# EAGLE design sensor-i2c-proto (EAGLE 9.0.0)
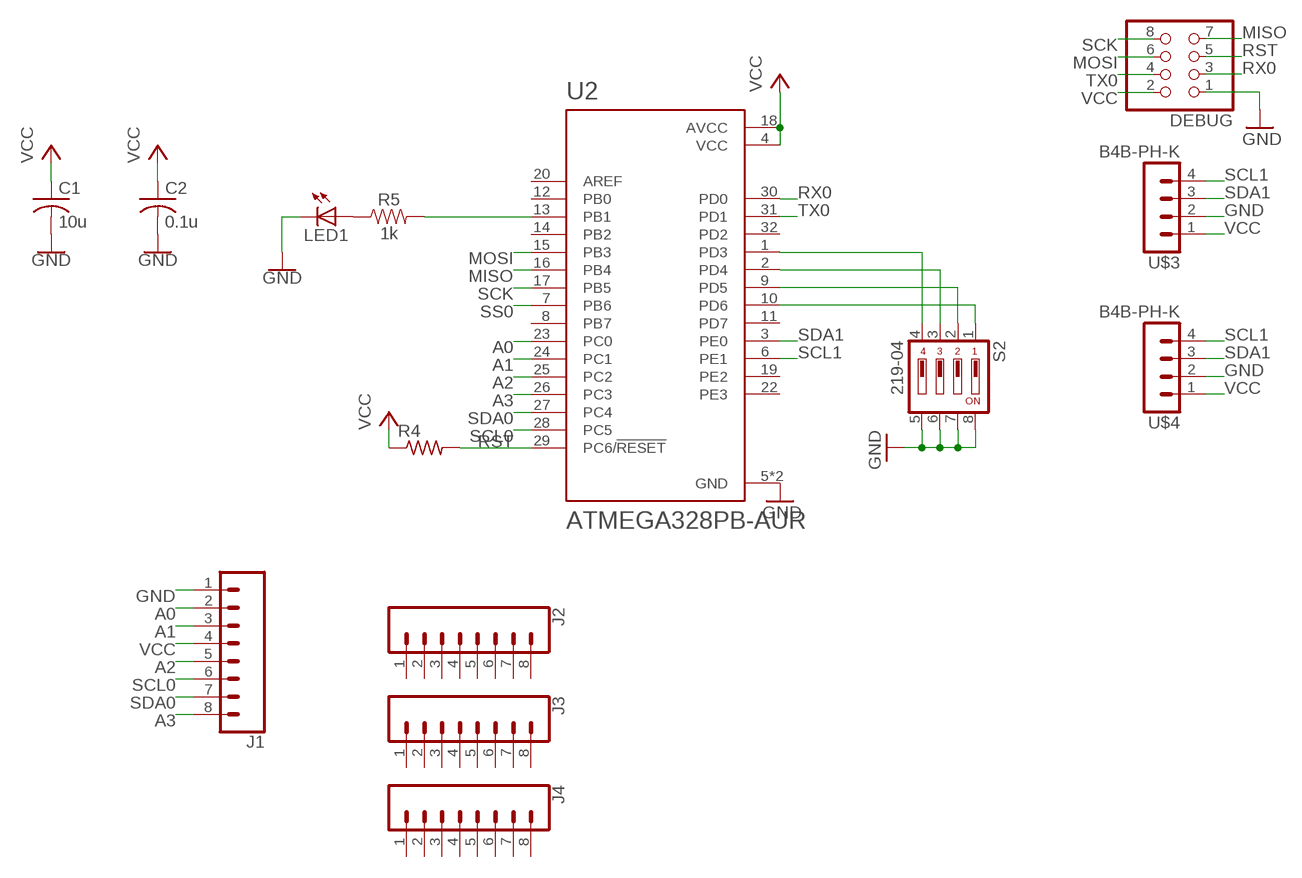
[diagram p0: schematic, sheet 1]

## Parts
C1  10u  C-USC0603  [C0603]
C2  0.1u  C-USC0603  [C0603]
DEBUG  PINHD-2X4  [2X04]
J1  CONN_08"  [1X08]
J2  CONN_08NO_SILK_FEMALE_PTH  [1X08_NO_SILK]
J3  CONN_08NO_SILK_FEMALE_PTH  [1X08_NO_SILK]
J4  CONN_08NO_SILK_FEMALE_PTH  [1X08_NO_SILK]
LED1  LEDSML0805  [SML0805]
R4  R-US_R0603  [R0603]
R5  1k  1KOHM-0603-1/10W-1%  [0603]
S2  219-04  [CTS-219-04]
U2  ATMEGA328PB-AUR  [QFP80P900X900X120-32N]
U$3  B4B-PH-K  [B4B-PH-K]
U$4  B4B-PH-K  [B4B-PH-K]

## Nets
A0: J1.2 U2.23(PC0)
A1: J1.3 U2.24(PC1)
A2: J1.5 U2.25(PC2)
A3: J1.8 U2.26(PC3)
GND: C1.2 C2.2 DEBUG.1 J1.1 LED1.C S2.5 S2.6 S2.7 S2.8 U2.5(GND) U2.21(GND) U$3.2 U$4.2
MISO: DEBUG.7 U2.16(PB4)
MOSI: DEBUG.6 U2.15(PB3)
N$1: S2.4 U2.1(PD3)
N$2: S2.3 U2.2(PD4)
N$3: S2.2 U2.9(PD5)
N$4: S2.1 U2.10(PD6)
N$12: LED1.A R5.1
N$13: R5.2 U2.13(PB1)
RST: DEBUG.5 R4.2 U2.29(PC6/!RESET)
RX0: DEBUG.3 U2.30(PD0)
SCK: DEBUG.8 U2.17(PB5)
SCL0: J1.6 U2.28(PC5)
SCL1: U2.6(PE1) U$3.4 U$4.4
SDA0: J1.7 U2.27(PC4)
SDA1: U2.3(PE0) U$3.3 U$4.3
SS0: U2.7(PB6)
TX0: DEBUG.4 U2.31(PD1)
VCC: C1.1 C2.1 DEBUG.2 J1.4 R4.1 U2.4(VCC) U2.18(AVCC) U$3.1 U$4.1
Unconnected: J2.1 J2.2 J2.3 J2.4 J2.5 J2.6 J2.7 J2.8 J3.1 J3.2 J3.3 J3.4 J3.5 J3.6 J3.7 J3.8 J4.1 J4.2 J4.3 J4.4 J4.5 J4.6 J4.7 J4.8 U2.8(PB7) U2.11(PD7) U2.12(PB0) U2.14(PB2) U2.19(PE2) U2.20(AREF) U2.22(PE3) U2.32(PD2)

## Library data of the parts
C1 C2 = resistor:C-US: CAPACITOR, American symbol
DEBUG = pinhead:PINHD-2X4: PIN HEADER
J1-J4 = SparkFun-Connectors:CONN_08: Multi connection point. Often used as Generic Header-pin footprint for 0.1 inch spaced/style header connections On any of the 0.1 inch spaced packages, you can populate with these: Break Away Headers - Straight <https://www.sparkfun.com/products/116> (PRT-00116) Break Away Male Headers - Right Angle <https://www.sparkfun.com/products/553> (PRT-00553) Female Headers <https://www.sparkfun.com/products/115> (PRT-00115) Break Away Headers - Machine Pin <https://www.sparkfun.com/products/117> (PRT-00117) Break Away Female Headers - Swiss Machine Pin <https://www.sparkfun.com/products/743> (PRT-00743) Arduino Stackable Header - 8 Pin <https://www.sparkfun.com/products/9279> (PRT-09279) For SCREWTERMINALS and SPRING TERMINALS visit here: Screw Terimnals on SparkFun.com <https://www.sparkfun.com/search/results?term=Screw+Terminals> (5mm/3.5mm/2.54mm spacing) This device is also useful as a general connection point to wire up your design to another part of your project. Our various solder wires solder well into these plated through hole pads. Hook-Up Wire - Assortment (Stranded, 22 AWG) <https://www.sparkfun.com/products/11375> (PRT-11375) Hook-Up Wire - Assortment (Solid Core, 22 AWG) <https://www.sparkfun.com/products/11367> (PRT-11367) View the entire wire category on our website here <https://www.sparkfun.com/categories/141> Special notes: Molex polarized connector foot print use with SKU : PRT-08231 with associated crimp pins and housings. 1MM SMD Version SKU: PRT-10208 NOTES ON THE VARIANTS LOCK and LOCK_LONGPADS... This footprint was designed to help hold the alignment of a through-hole component (i.e. 6-pin header) while soldering it into place. You may notice that each hole has been shifted either up or down by 0.005 of an inch from it's more standard position (which is a perfectly straight line). This slight alteration caused the pins (the squares in the middle) to touch the edges of the holes. Because they are alternating, it causes a "brace" to hold the component in place. 0.005 has proven to be the perfect amount of "off-center" position when using our standard breakaway headers. Although looks a little odd when you look at the bare footprint, once you have a header in there, the alteration is very hard to notice. Also,if you push a header all the way into place, it is covered up entirely on the bottom side.; PROD_ID: CONN-08438
LED1 = led:LED: LED OSRAM: - CHIPLED LG R971, LG N971, LY N971, LG Q971, LY Q971, LO R971, LY R971 LH N974, LH R974 LS Q976, LO Q976, LY Q976 LO Q996 - Hyper CHIPLED LW Q18S LB Q993, LB Q99A, LB R99A - SideLED LS A670, LO A670, LY A670, LG A670, LP A670 LB A673, LV A673, LT A673, LW A673 LH A674 LY A675 LS A676, LA A676, LO A676, LY A676, LW A676 LS A679, LY A679, LG A679 - Hyper Micro SIDELED® LS Y876, LA Y876, LO Y876, LY Y876 LT Y87S - SmartLED LW L88C, LW L88S LB L89C, LB L89S, LG L890 LS L89K, LO L89K, LY L89K LS L896, LA L896, LO L896, LY L896 - TOPLED LS T670, LO T670, LY T670, LG T670, LP T670 LSG T670, LSP T670, LSY T670, LOP T670, LYG T670 LG T671, LOG T671, LSG T671 LB T673, LV T673, LT T673, LW T673 LH T674 LS T676, LA T676, LO T676, LY T676, LB T676, LH T676, LSB T676, LW T676 LB T67C, LV T67C, LT T67C, LS T67K, LO T67K, LY T67K, LW E67C LS E67B, LA E67B, LO E67B, LY E67B, LB E67C, LV E67C, LT E67C LW T67C LS T679, LY T679, LG T679 LS T770, LO T770, LY T770, LG T770, LP T770 LB T773, LV T773, LT T773, LW T773 LH T774 LS E675, LA E675, LY E675, LS T675 LS T776, LA T776, LO T776, LY T776, LB T776 LHGB T686 LT T68C, LB T68C - Hyper Mini TOPLED® LB M676 - Mini TOPLED Santana® LG M470 LS M47K, LO M47K, LY M47K Source: http://www.osram.convergy.de LUXEON: - LUMILED® LXK2-PW12-R00, LXK2-PW12-S00, LXK2-PW14-U00, LXK2-PW14-V00 LXK2-PM12-R00, LXK2-PM12-S00, LXK2-PM14-U00 LXK2-PE12-Q00, LXK2-PE12-R00, LXK2-PE12-S00, LXK2-PE14-T00, LXK2-PE14-U00 LXK2-PB12-K00, LXK2-PB12-L00, LXK2-PB12-M00, LXK2-PB14-N00, LXK2-PB14-P00, LXK2-PB14-Q00 LXK2-PR12-L00, LXK2-PR12-M00, LXK2-PR14-Q00, LXK2-PR14-R00 LXK2-PD12-Q00, LXK2-PD12-R00, LXK2-PD12-S00 LXK2-PH12-R00, LXK2-PH12-S00 LXK2-PL12-P00, LXK2-PL12-Q00, LXK2-PL12-R00 Source: www.luxeon.com KINGBRIGHT: KA-3528ASYC Source: www.kingbright.com
R4 = resistor:R-US_: RESISTOR, American symbol
R5 = SparkFun-Resistors:1KOHM: 1kΩ resistor A resistor is a passive two-terminal electrical component that implements electrical resistance as a circuit element. Resistors act to reduce current flow, and, at the same time, act to lower voltage levels within circuits. - Wikipedia; PROD_ID: RES-07856
S2 = switch-dil:219-04*: Surface Mount DIP Switch Series 219 SMT CTS Electronic Components Sourc: www.ctscorp.com; OC_FARNELL: unknown; OC_NEWARK: unknown
U2 = ATMEGA328PB-AUR:ATMEGA328PB-AUR: ATmega Series 20 MHz 32 KB Flash 2 KB SRAM 8-Bit Microcontroller - TQFP-32; DESCRIPTION: AVR microcontroller; EEPROM: 1024B; SRAM: 2kB; Flash: 32kB; TQFP32; DIGI-KEY_PART_NUMBER: ATMEGA328PB-AURCT-ND; DIGI-KEY_PURCHASE_URL: https://www.digikey.com/product-detail/en/microchip-technology/ATMEGA328PB-AUR/ATMEGA328PB-AURCT-ND/5722706?WT.z_cid=ref_snapeda&utm_source=snapeda&utm_medium=aggregator&utm_campaign=buynow; MF: Microchip; MP: ATMEGA328PB-AUR; PACKAGE: TQFP-32 Microchip
U$3 U$4 = con-jst-ph:B4B-PH-K: HEADER

## Module 2
Ports: 

### Library data of the parts

## Board
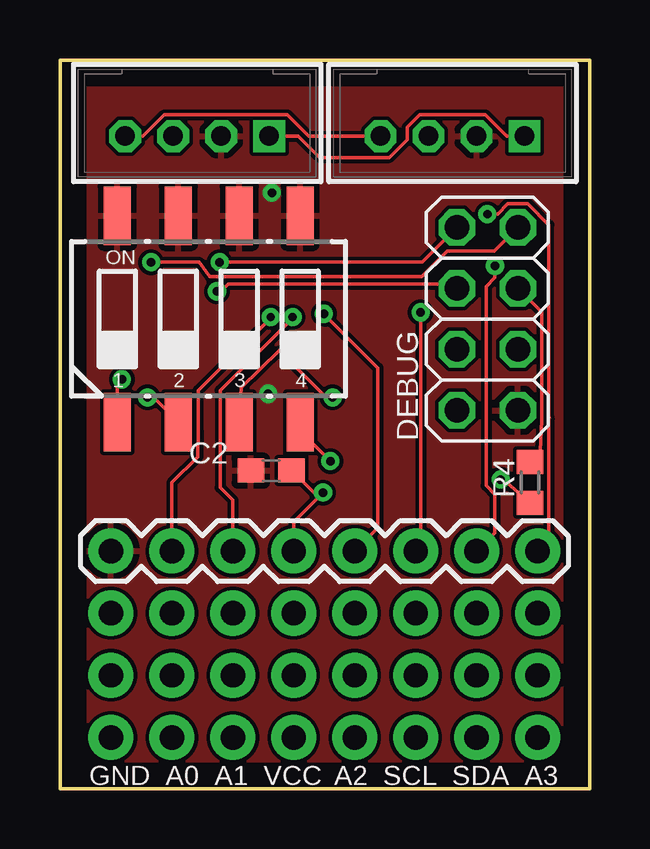
[diagram p1: board, top side]
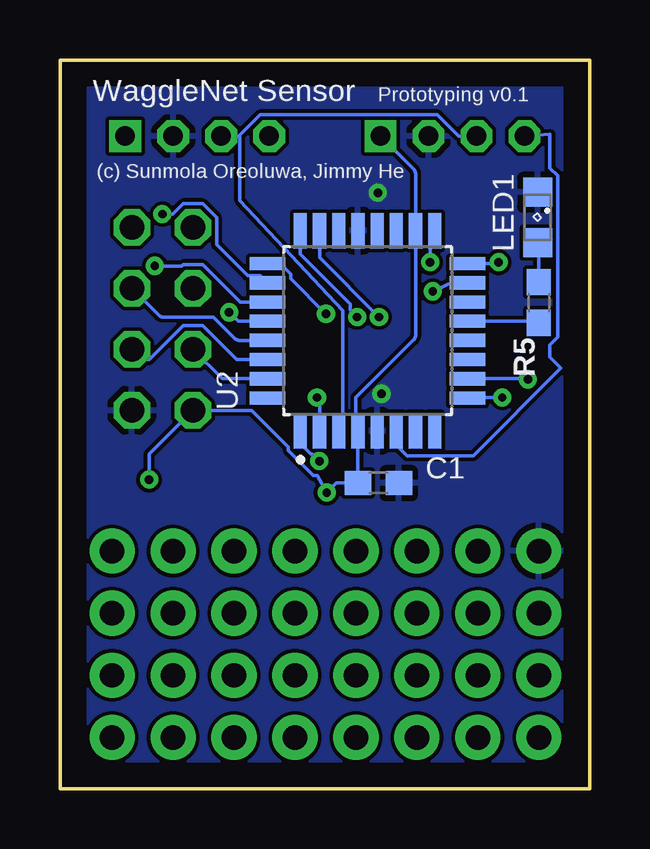
[diagram p2: board, bottom side, seen from below]

Size 22.07 x 30.38 mm. Coordinates in mm from the lower left corner, seen from the top.
Outline: 0,0 0,30.38 22.07,30.38 22.07,0 0,0
Copper layers (1*16): Top 0.035mm / dielectric 1.5mm / Bottom 0.035mm
Design rules "default": minimum track width 6mil, minimum drill 0.35mm, track to track 6mil, track to pad 6mil, pad to pad 6mil, via to via 6mil, smd to smd 6mil, copper to edge 40mil, drill to drill 6mil, minimum pad ring 10mil, minimum via ring 8mil, stop-mask expansion 4mil, vias tented up to drill 0mil, thermal gap 10mil

### Footprints (pad centres in the part's own frame; a part is rotated, then mirrored left to right if it is on the bottom)
C0603 = smd 1.1 x 1: 1 -0.85,0; 2 0.85,0
2X04 = drill 1.016 octagon: 1 -3.81,-1.27; 2 -3.81,1.27; 3 -1.27,-1.27; 4 -1.27,1.27; 5 1.27,-1.27; 6 1.27,1.27; 7 3.81,-1.27; 8 3.81,1.27
1X08 = drill 1.016 pad 1.88: 1 0,0; 2 2.54,0; 3 5.08,0; 4 7.62,0; 5 10.16,0; 6 12.7,0; 7 15.24,0; 8 17.78,0
1X08_NO_SILK = drill 1.016 pad 1.88: 1 0,0; 2 2.54,0; 3 5.08,0; 4 7.62,0; 5 10.16,0; 6 12.7,0; 7 15.24,0; 8 17.78,0
SML0805 = smd 1.2 x 1.2: A 1.05,0; C -1.05,0
R0603 = smd 1 x 1.1: 1 -0.85,0; 2 0.85,0
0603 = smd 1.1 x 1: 1 -0.85,0; 2 0.85,0
CTS-219-04 = smd 1.13 x 2.44: 1 -3.81,-4.3; 2 -1.27,-4.3; 3 1.27,-4.3; 4 3.81,-4.3; 5 3.81,4.3; 6 1.27,4.3; 7 -1.27,4.3; 8 -3.81,4.3
QFP80P900X900X120-32N = smd 1.47 x 0.55: 1 -4.17,2.8; 2 -4.17,2; 3 -4.17,1.2; 4 -4.17,0.4; 5 -4.17,-0.4; 6 -4.17,-1.2; 7 -4.17,-2; 8 -4.17,-2.8; 17 4.17,-2.8; 18 4.17,-2; 19 4.17,-1.2; 20 4.17,-0.4; 21 4.17,0.4; 22 4.17,1.2; 23 4.17,2; 24 4.17,2.8 | smd 0.55 x 1.47: 9 -2.8,-4.17; 10 -2,-4.17; 11 -1.2,-4.17; 12 -0.4,-4.17; 13 0.4,-4.17; 14 1.2,-4.17; 15 2,-4.17; 16 2.8,-4.17; 25 2.8,4.17; 26 2,4.17; 27 1.2,4.17; 28 0.4,4.17; 29 -0.4,4.17; 30 -1.2,4.17; 31 -2,4.17; 32 -2.8,4.17
B4B-PH-K = drill 0.813 square: 1 -3,0 | drill 0.813 octagon: 2 -1,0; 3 1,0; 4 3,0

### Placement (x,y rotation side)
C1  8.8,12.74 0 bottom
C2  8.8,13.26 180 top
DEBUG  17.81,19.58 90 top
J1  2.12,9.91 0 top
J2  2.12,7.32 0 top
J3  2.12,4.72 0 top
J4  2.12,2.13 0 top
LED1  2.17,23.81 270 bottom
R4  19.58,12.76 90 top
R5  2.12,20.27 270 bottom
S2  6.2,19.58 0 top
U2  9.26,19.09 90 bottom
U$3  16.36,27.2 180 top
U$4  5.71,27.2 180 top

### Tracks (layer width: path | path; a pad name or v marks a point on that pad's centre or on a via)
A0  (via drill 0.35)
  Top 0.152: v8.78,19.66 8.78,19.62 5.76,16.6 5.76,14.92 5.74,13.83 4.66,12.76 J1.2
  Bottom 0.152: U2.23 11.26,22.14 v8.78,19.66
A1  (via drill 0.35)
  Top 0.152: v9.69,19.66 9.69,19.61 6.67,16.6 6.67,12.55 7.2,12.03 J1.3
  Bottom 0.152: v9.69,19.66 9.99,19.96 9.99,20.21 12.06,22.28 U2.24
A2  (via drill 0.35)
  Top 0.152: v10.99,19.79 13.25,17.54 13.25,10.87 J1.5
  Bottom 0.152: U2.25 13.44,21.9 12.91,21.9 12.47,21.46 12.47,21.27 v10.99,19.79
A3  (via drill 0.35)
  Top 0.152: v17.81,23.95 18.23,23.95 18.67,24.38 19.49,24.38 20.37,23.5 20.37,15.48 20.38,15.47 20.37,15.36 20.37,10.38 J1.8
  Bottom 0.152: U2.26 13.73,21.38 14.26,21.38 15.55,22.67 15.55,23.8 16.13,24.38 16.95,24.38 17.38,23.95 v17.81,23.95
GND  (via drill 0.35)
  other vias: 8.83,24.84 8.67,16.46
  pour Top: 30.01,34.19 30.01,-2.64 -6.82,-2.64 -6.82,34.19
  pour Bottom: 27.47,32.92 27.47,-1.37 -4.28,-1.37 -4.28,32.92
MISO  (via drill 0.35)
  Top 0.152: DEBUG.7 18.09,22.4 16.13,22.4 15.06,21.34 6.25,21.34 5.79,21.95 v3.8,21.95
  Bottom 0.152: U2.16 3.86,21.89 v3.8,21.95
MOSI  (via drill 0.35)
  Top 0.152: v6.54,20.73 6.7,20.73 7,21.03 16.36,21.03 DEBUG.6
  Bottom 0.152: U2.15 5.9,21.04 v6.54,20.73
N$1  (via drill 0.35)
  Top 0.152: v11.27,13.65 10.01,14.91 S2.4
  Bottom 0.152: v11.27,13.65 11.57,13.95 11.63,13.95 12.06,14.38 U2.1
N$2  (via drill 0.35)
  Top 0.152: v11.36,16.31 11.09,16.31 9.14,18.26 7.54,16.73 S2.3
  Bottom 0.152: U2.2 11.26,16.2 v11.36,16.31
N$3  (via drill 0.35)
  Top 0.152: S2.2 3.9,16.31 v3.65,16.31
  Bottom 0.152: v3.65,16.31 5.07,16.31 U2.9
N$4  (via drill 0.35)
  Top 0.152: v2.58,17.07 2.39,16.88 S2.1
  Bottom 0.152: U2.10 2.6,17.09 v2.58,17.07
N$12
  Bottom 0.152: R5.1 2.12,22.71 LED1.A
N$13
  Bottom 0.152: U2.13 2.19,19.49 R5.2
RST
  Top 0.152: R4.2 20,14.08 20.07,15.36 20.07,19.86 DEBUG.5
  Bottom 0.152: U2.29 14.61,18.69 arc45 14.79,18.76 15.68,19.66 17.78,19.66 arc45 17.96,19.73 DEBUG.5
RX0
  Bottom 0.152: DEBUG.3 18.65,17.89 18.36,17.89 16.95,19.3 16.13,19.3 14.71,17.89 U2.30
SCK  (via drill 0.35)
  Top 0.152: v6.65,21.95 15.09,21.95 DEBUG.8
  Bottom 0.152: U2.17 6.65,23.07 v6.65,21.95
SCL0  (via drill 0.35)
  Top 0.152: v15.03,19.86 15.03,10.11 J1.6
  Bottom 0.152: U2.28 14.66,19.49 v15.03,19.86
SCL1
  Top 0.152: U$4.4 3.46,27.2 4.35,28.09 9.47,28.09 10.36,27.2 U$3.4
  Bottom 0.152: U2.6 7.91,14.78 7.91,14.17 7.61,13.87 4.86,13.87 1.21,17.53 1.66,17.98 1.66,18.5 1.34,18.82 1.34,25.56 1.66,25.88 1.66,27.28 U$4.4
SDA0  (via drill 0.35)
  Top 0.152: J1.7 18.12,10.67 18.12,12.26 17.75,12.63 17.75,20.93 18.12,21.3 v18.12,21.79
  Bottom 0.152: U2.27 14.57,20.29 16.13,21.84 16.95,21.84 17,21.79 v18.12,21.79
SDA1
  Bottom 0.152: U$4.3 5.46,27.2 6.35,28.09 13.73,28.09 14.58,27.24 | U$3.3 14.62,27.2 14.58,27.24 | U2.3 10.3,15.21 10.3,19.94 14.58,24.52 14.58,27.24
TX0
  Bottom 0.152: U2.31 15.31,17.09 DEBUG.4
VCC  (via drill 0.35)
  Top 0.152: U$4.1 9.93,27.2 10.82,26.31 13.73,26.31 14.47,27.06 14.47,27.57 14.99,28.09 17.73,28.09 18.62,27.2 U$3.1 | R4.1 18.46,12.89 v18.36,12.89 | J1.4 9.74,11.13 v10.96,12.34 10.57,12.34 C2.1
  Bottom 0.152: U2.4 9.66,14.78 | 9.66,14.78 9.66,12.76 arc-45 C1.1 | C1.1 9.82,12.57 | U$4.1 7.33,25.82 arc45 7.26,25.64 U2.18 7.26,18.89 arc45 7.33,18.72 9.74,16.31 9.74,14.97 arc-45 9.67,14.79 9.66,14.78 | v18.36,12.89 18.36,13.95 DEBUG.2 14.08,15.77 12.56,14.25 12.56,14.09 11.52,13.05 11.36,13.05 v10.96,12.34 10.57,12.74 C1.1

### Text on the board
tNames: GND A0 A1 VCC | A2 SCL SDA A3
bNames: Prototyping v0.1 | WaggleNet Sensor | (c) Sunmola Oreoluwa, Jimmy He